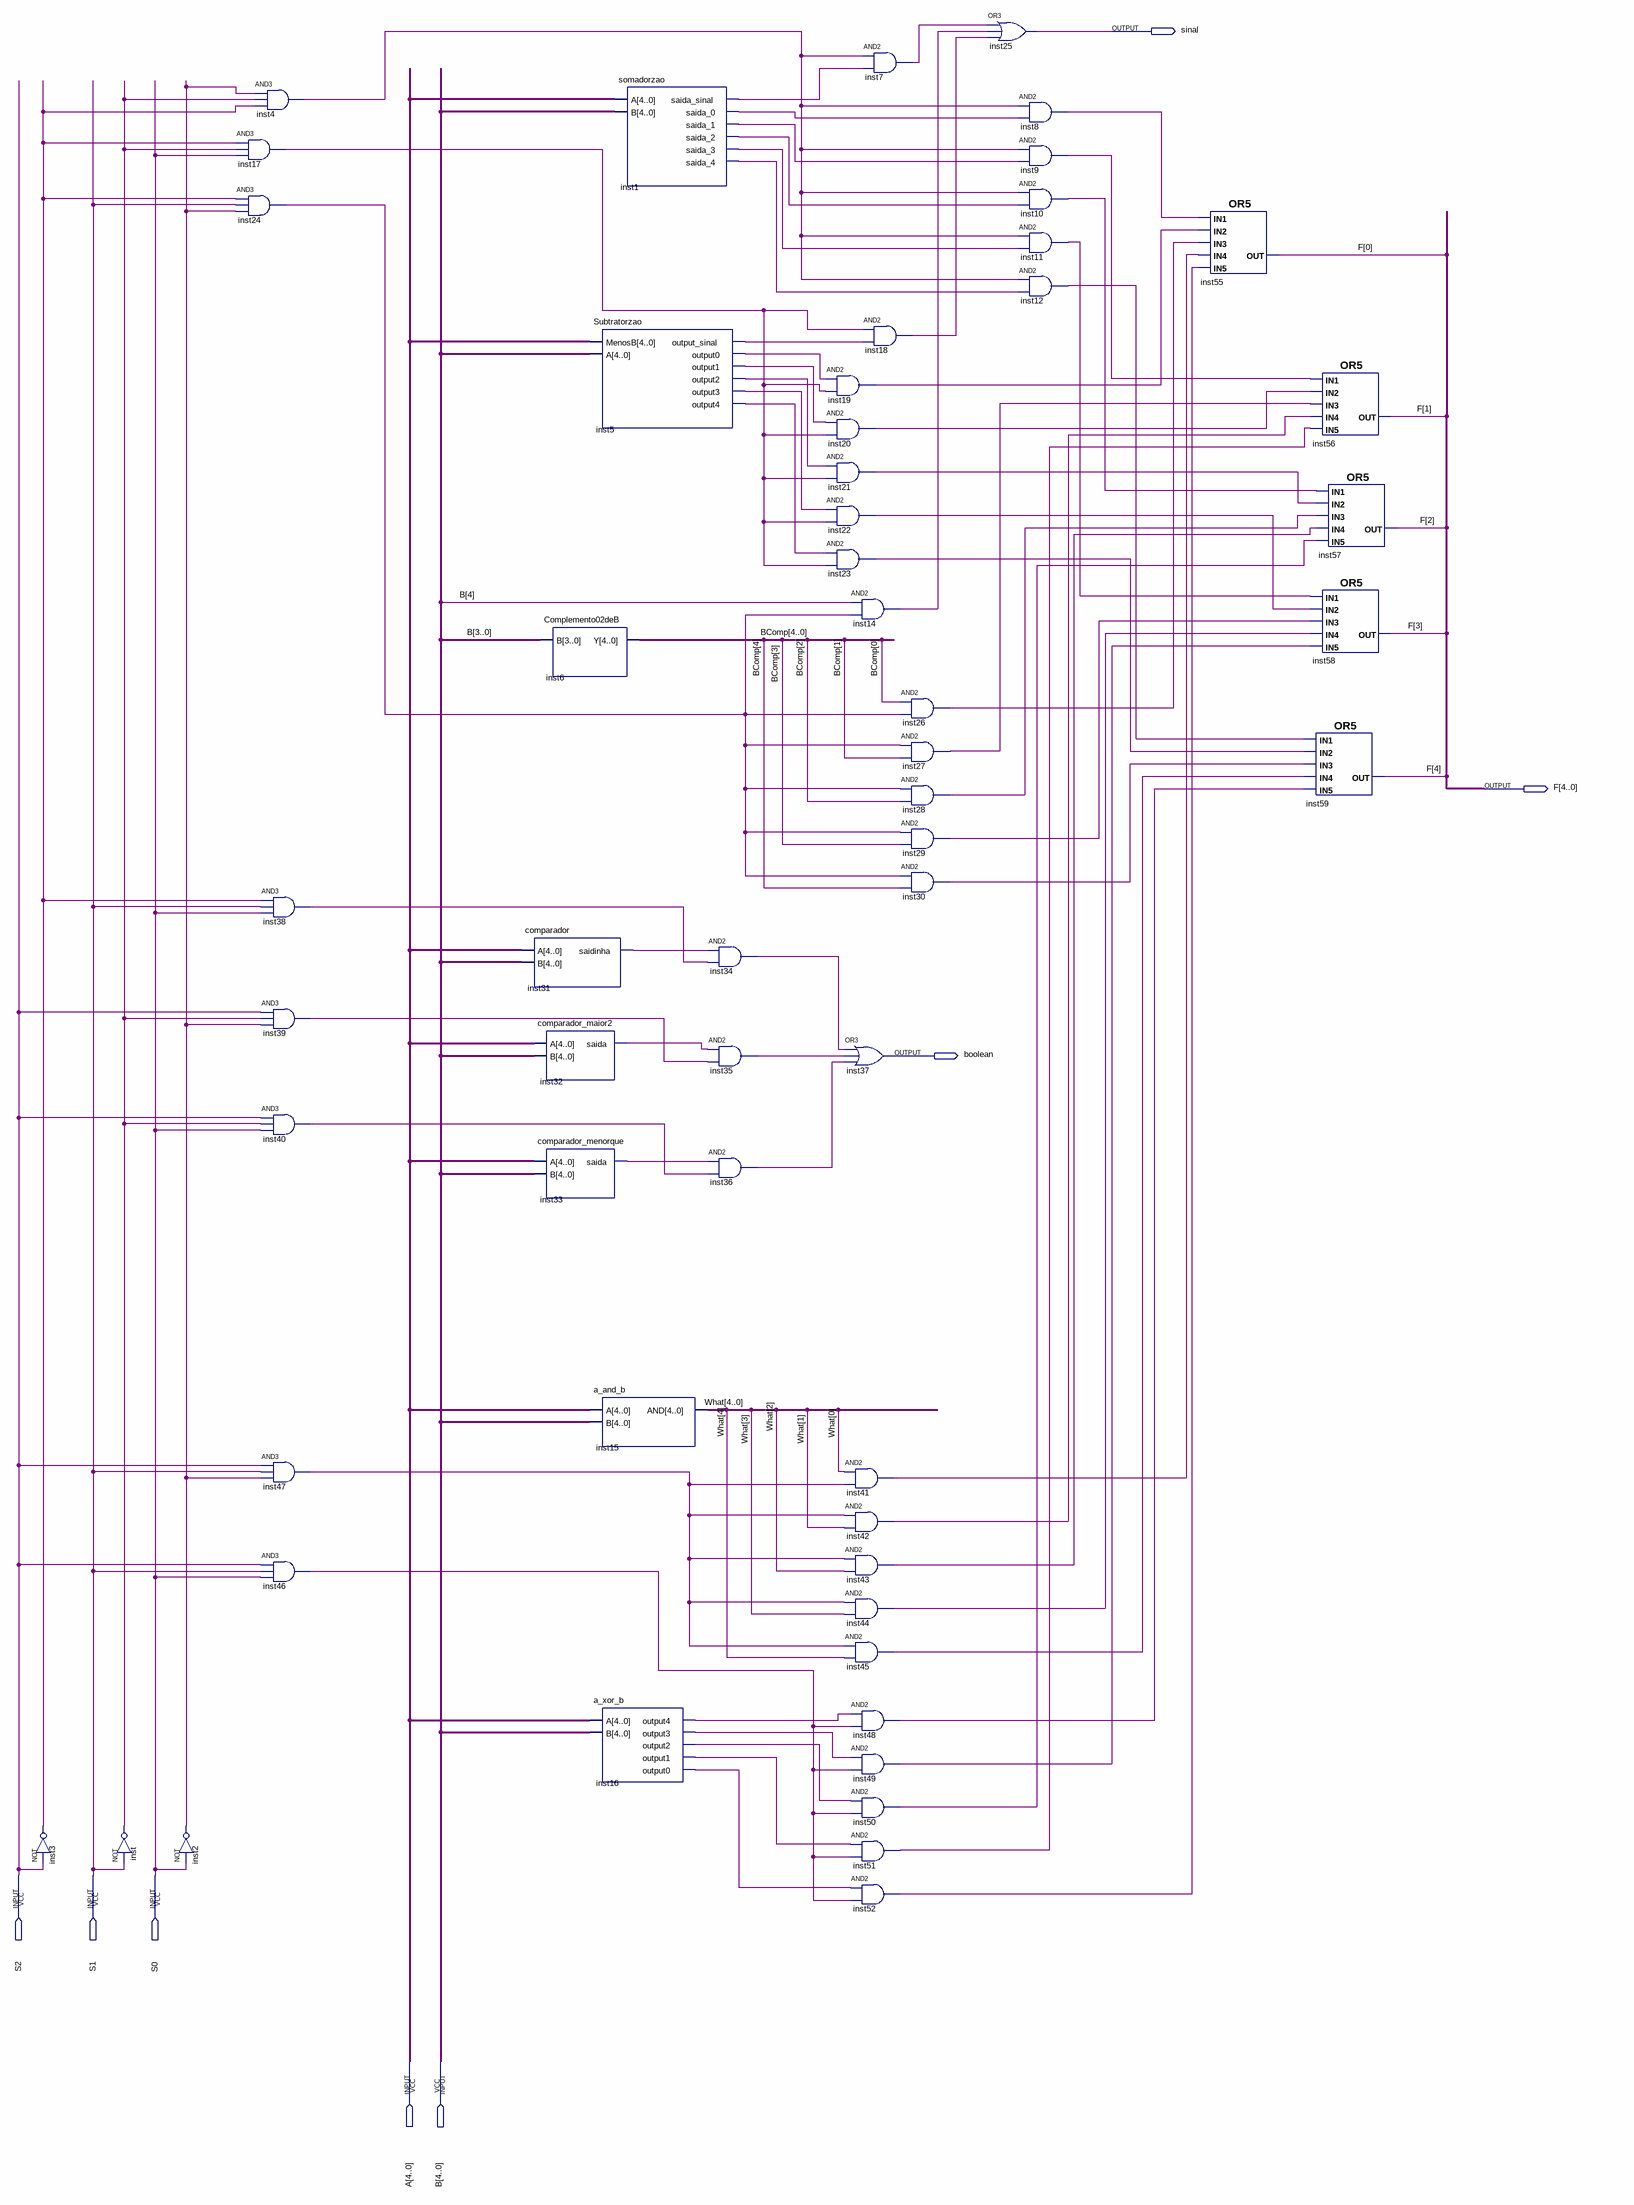
[diagram p0: schematic sheet]
// Quartus schematic the_other.bdf as structural Verilog: 57 symbols, 8 pins
module the_other (
  input  S2,
  input  S1,
  input  S0,
  input  [4:0] A,
  input  [4:0] B,
  output sinal,
  output [4:0] F,
  output boolean
);

  wire inst1_saida_0, inst1_saida_1, inst1_saida_2, inst1_saida_3, inst1_saida_4, inst1_saida_sinal,
       inst2_out, inst3_out, inst4_out, inst5_output0, inst5_output1, inst5_output2, inst5_output3,
       inst5_output4, inst5_output_sinal, inst7_out, inst8_out, inst9_out, inst10_out, inst11_out,
       inst12_out, inst14_out, inst16_output0, inst16_output1, inst16_output2, inst16_output3,
       inst16_output4, inst17_out, inst18_out, inst19_out, inst20_out, inst21_out, inst22_out, inst23_out,
       inst24_out, inst26_out, inst27_out, inst28_out, inst29_out, inst30_out, inst31_saidinha, inst32_saida,
       inst33_saida, inst34_out, inst35_out, inst36_out, inst38_out, inst39_out, inst40_out, inst41_out,
       inst42_out, inst43_out, inst44_out, inst45_out, inst46_out, inst47_out, inst48_out, inst49_out,
       inst50_out, inst51_out, inst52_out, inst_out;
  wire [4:0] BComp, What;

  not inst3 (inst3_out, S2);
  not inst (inst_out, S1);
  not inst2 (inst2_out, S0);
  and inst17 (inst17_out, inst3_out, inst_out, S0);
  and inst24 (inst24_out, inst3_out, S1, inst2_out);
  and inst4 (inst4_out, inst2_out, inst_out, inst3_out);
  and inst38 (inst38_out, inst3_out, S1, S0);
  and inst39 (inst39_out, S2, inst_out, inst2_out);
  and inst40 (inst40_out, S2, inst_out, S0);
  and inst47 (inst47_out, S2, S1, inst2_out);
  and inst46 (inst46_out, S2, S1, S0);
  Complemento02deB inst6 (.B(B[3:0]), .Y(BComp));
  comparador inst31 (.A(A), .B(B), .saidinha(inst31_saidinha));
  comparador_maior2 inst32 (.A(A), .B(B), .saida(inst32_saida));
  comparador_menorque inst33 (.A(A), .B(B), .saida(inst33_saida));
  Subtratorzao inst5 (
    .MenosB(A), .A(B), .output_sinal(inst5_output_sinal), .output0(inst5_output0), .output1(inst5_output1),
    .output2(inst5_output2), .output3(inst5_output3), .output4(inst5_output4));
  a_and_b inst15 (.A(A), .B(B), .AND(What));
  a_xor_b inst16 (
    .A(A), .B(B), .output4(inst16_output4), .output3(inst16_output3), .output2(inst16_output2),
    .output1(inst16_output1), .output0(inst16_output0));
  somadorzao inst1 (
    .A(A), .B(B), .saida_sinal(inst1_saida_sinal), .saida_0(inst1_saida_0), .saida_1(inst1_saida_1),
    .saida_2(inst1_saida_2), .saida_3(inst1_saida_3), .saida_4(inst1_saida_4));
  and inst34 (inst34_out, inst31_saidinha, inst38_out);
  and inst35 (inst35_out, inst32_saida, inst39_out);
  and inst36 (inst36_out, inst33_saida, inst40_out);
  and inst19 (inst19_out, inst5_output0, inst17_out);
  and inst20 (inst20_out, inst5_output1, inst17_out);
  and inst21 (inst21_out, inst5_output2, inst17_out);
  and inst22 (inst22_out, inst5_output3, inst17_out);
  and inst23 (inst23_out, inst5_output4, inst17_out);
  or inst37 (boolean, inst34_out, inst35_out, inst36_out);
  and inst41 (inst41_out, What[0], inst47_out);
  and inst42 (inst42_out, inst47_out, What[1]);
  and inst43 (inst43_out, inst47_out, What[2]);
  and inst44 (inst44_out, inst47_out, What[3]);
  and inst45 (inst45_out, inst47_out, What[4]);
  and inst7 (inst7_out, inst4_out, inst1_saida_sinal);
  and inst18 (inst18_out, inst17_out, inst5_output_sinal);
  and inst14 (inst14_out, B[4], inst24_out);
  and inst48 (inst48_out, inst16_output4, inst46_out);
  and inst49 (inst49_out, inst16_output3, inst46_out);
  and inst50 (inst50_out, inst16_output2, inst46_out);
  and inst51 (inst51_out, inst16_output1, inst46_out);
  and inst52 (inst52_out, inst16_output0, inst46_out);
  and inst26 (inst26_out, BComp[0], inst24_out);
  and inst27 (inst27_out, inst24_out, BComp[1]);
  and inst28 (inst28_out, inst24_out, BComp[2]);
  and inst29 (inst29_out, inst24_out, BComp[3]);
  and inst30 (inst30_out, inst24_out, BComp[4]);
  or inst25 (sinal, inst7_out, inst14_out, inst18_out);
  and inst8 (inst8_out, inst4_out, inst1_saida_0);
  and inst9 (inst9_out, inst4_out, inst1_saida_1);
  and inst10 (inst10_out, inst4_out, inst1_saida_2);
  and inst11 (inst11_out, inst4_out, inst1_saida_3);
  and inst12 (inst12_out, inst4_out, inst1_saida_4);
  or inst55 (F[0], inst8_out, inst19_out, inst26_out, inst41_out, inst52_out);
  or inst56 (F[1], inst9_out, inst20_out, inst27_out, inst42_out, inst51_out);
  or inst57 (F[2], inst10_out, inst21_out, inst28_out, inst43_out, inst50_out);
  or inst58 (F[3], inst11_out, inst22_out, inst29_out, inst44_out, inst49_out);
  or inst59 (F[4], inst12_out, inst23_out, inst30_out, inst45_out, inst48_out);
endmodule
